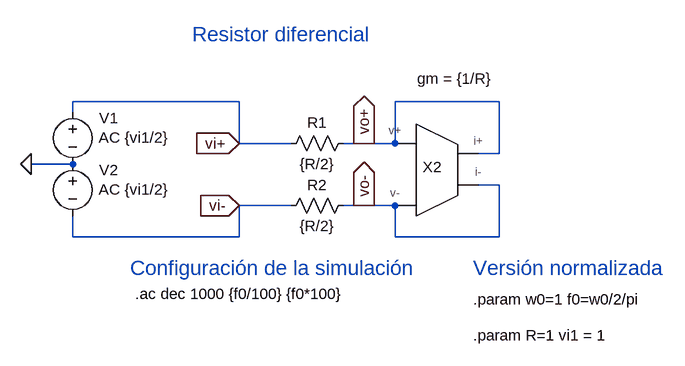
[diagram p0: schematic OTA R diferencial.asc]
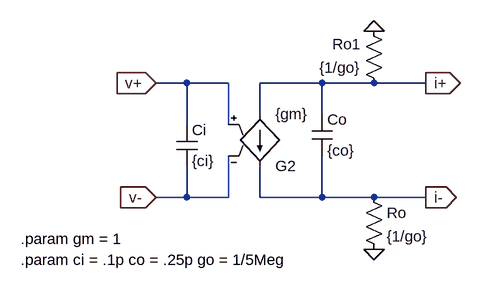
[diagram p1: sub-circuit ota_diff.asc]
OTA R diferencial.asc, the LTspice schematic file:
Version 4
SHEET 1 944 880
WIRE 160 64 -96 64
WIRE 560 64 400 64
WIRE -96 80 -96 64
WIRE 160 128 160 64
WIRE 240 128 160 128
WIRE 352 128 320 128
WIRE 400 128 400 64
WIRE 400 128 352 128
WIRE 560 144 560 64
WIRE 560 144 528 144
WIRE -96 160 -160 160
WIRE 560 192 528 192
WIRE 240 224 160 224
WIRE 352 224 320 224
WIRE 400 224 352 224
WIRE -96 272 -96 240
WIRE 160 272 160 224
WIRE 160 272 -96 272
WIRE 400 272 400 224
WIRE 560 272 560 192
WIRE 560 272 400 272
FLAG 160 128 vi+
IOPIN 160 128 In
FLAG 352 128 vo+
IOPIN 352 128 Out
FLAG 160 224 vi-
IOPIN 160 224 In
FLAG -160 160 0
FLAG 352 224 vo-
IOPIN 352 224 Out
SYMBOL res 224 144 R270
WINDOW 0 32 56 VTop 2
WINDOW 3 0 56 VBottom 2
SYMATTR InstName R1
SYMATTR Value {R/2}
SYMBOL voltage -96 64 R0
WINDOW 123 40 55 Left 2
WINDOW 39 0 0 Left 0
WINDOW 0 41 25 Left 2
SYMATTR Value2 AC {vi1/2}
SYMATTR InstName V1
SYMATTR Value ""
SYMBOL OTA_diff 480 176 R0
WINDOW 0 -23 -27 Top 2
WINDOW 39 12 -163 Top 2
SYMATTR InstName X2
SYMATTR SpiceLine gm = {1/R}
SYMBOL voltage -96 144 R0
WINDOW 123 40 55 Left 2
WINDOW 39 0 0 Left 0
WINDOW 0 41 25 Left 2
SYMATTR Value2 AC {vi1/2}
SYMATTR InstName V2
SYMATTR Value ""
SYMBOL res 224 240 R270
WINDOW 0 32 56 VTop 2
WINDOW 3 0 56 VBottom 2
SYMATTR InstName R2
SYMATTR Value {R/2}
TEXT 0 360 Left 2 !.ac dec 1000 {f0/100} {f0*100}
TEXT 520 424 Left 2 !.param R=1 vi1 = 1
TEXT -8 320 Left 3 ;Configuración de la simulación
TEXT 520 320 Left 3 ;Versión normalizada
TEXT 520 368 Left 2 !.param w0=1 f0=w0/2/pi
TEXT 88 -40 Left 3 ;Resistor diferencial

ota_diff.asc, the sub-circuit schematic file:
Version 4
SHEET 1 880 680
WIRE -16 80 -64 80
WIRE 48 80 -16 80
WIRE 192 80 96 80
WIRE 272 80 192 80
WIRE 352 80 272 80
WIRE 96 128 96 80
WIRE 192 128 192 80
WIRE -16 144 -16 80
WIRE 48 144 48 80
WIRE -16 256 -16 208
WIRE -16 256 -64 256
WIRE 48 256 48 192
WIRE 48 256 -16 256
WIRE 96 256 96 208
WIRE 192 256 192 192
WIRE 192 256 96 256
WIRE 272 256 192 256
WIRE 352 256 272 256
FLAG 352 80 i+
IOPIN 352 80 Out
FLAG 352 256 i-
IOPIN 352 256 Out
FLAG -64 80 v+
IOPIN -64 80 In
FLAG -64 256 v-
IOPIN -64 256 In
FLAG 272 336 0
FLAG 272 0 0
SYMBOL cap -32 144 R0
SYMATTR InstName Ci
SYMATTR Value {ci}
SYMBOL cap 176 128 R0
SYMATTR InstName Co
SYMATTR Value {co}
SYMBOL res 256 240 R0
SYMATTR InstName Ro
SYMATTR Value {1/go}
SYMBOL g2 96 224 M180
SYMATTR InstName G2
SYMATTR Value {gm}
SYMBOL res 288 96 R180
WINDOW 0 36 76 Left 2
WINDOW 3 36 40 Left 2
SYMATTR InstName Ro1
SYMATTR Value {1/go}
TEXT -272 320 Left 2 !.param gm = 1
TEXT -272 352 Left 2 !.param ci = .1p co = .25p go = 1/5Meg

The netlist it stands for:
* OTA R diferencial.asc
R1 vi+ vo+ {R/2}
V1 vi+ 0 AC {vi1/2}
XX2 vo- vo+ vo+ vo- ota_diff params: gm = {1/R}
V2 0 vi- AC {vi1/2}
R2 vi- vo- {R/2}

* block symbol definitions
.subckt ota_diff i- i+ v+ v-
Ci v+ v- {ci}
Co i+ i- {co}
Ro i- 0 {1/go}
G2 i+ i- v+ v- {gm}
Ro1 i+ 0 {1/go}
.param gm = 1
.param ci = .1p co = .25p go = 1/5Meg
.ends ota_diff

.ac dec 1000 {f0/100} {f0*100}
.param R=1 vi1 = 1
* Configuración de la simulación
* Versión normalizada
.param w0=1 f0=w0/2/pi
* Resistor diferencial
.backanno
.end